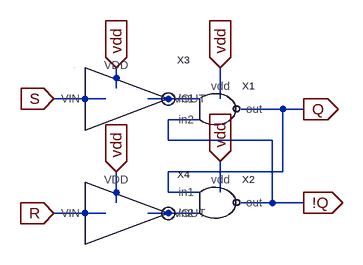
[diagram p0: schematic rs.asc]
rs.asc, the LTspice schematic file:
Version 4
SHEET 1 880 680
WIRE 64 32 64 0
WIRE 48 48 -32 48
WIRE 192 48 112 48
WIRE 224 48 224 0
WIRE 320 64 256 64
WIRE 352 64 320 64
WIRE 192 80 144 80
WIRE 144 112 144 80
WIRE 304 112 144 112
WIRE 320 160 320 64
WIRE 320 160 144 160
WIRE 144 192 144 160
WIRE 192 192 144 192
WIRE 224 192 224 144
WIRE 64 208 64 160
WIRE 304 208 304 112
WIRE 304 208 256 208
WIRE 352 208 304 208
WIRE 48 224 -32 224
WIRE 192 224 112 224
WIRE 0 0 0 0
FLAG -32 48 S
IOPIN -32 48 In
FLAG -32 224 R
IOPIN -32 224 In
FLAG 352 64 Q
IOPIN 352 64 Out
FLAG 352 208 !Q
IOPIN 352 208 Out
FLAG 224 0 vdd
IOPIN 224 0 In
FLAG 224 144 vdd
IOPIN 224 144 In
FLAG 64 0 vdd
IOPIN 64 0 In
FLAG 64 160 vdd
IOPIN 64 160 In
SYMBOL nand 208 64 R0
SYMATTR InstName X1
SYMBOL nand 208 208 R0
SYMATTR InstName X2
SYMBOL inverter 64 48 R0
SYMATTR InstName X3
SYMBOL inverter 64 224 R0
SYMATTR InstName X4

The netlist it stands for:
* rs.asc
XX1 N001 !Q Q vdd nand  ; pins in1 in2 out vdd
XX2 Q N002 !Q vdd nand  ; pins in1 in2 out vdd
XX3 vdd N001 S inverter  ; pins VDD VOUT VIN
XX4 vdd N002 R inverter  ; pins VDD VOUT VIN
.backanno
.end